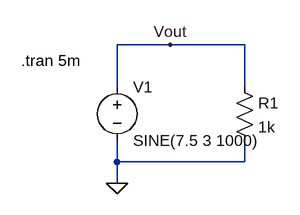
[diagram p0: schematic Plot with Offset.asc]
Plot with Offset.asc, the LTspice schematic file:
Version 4
SHEET 1 880 680
WIRE 176 64 96 64
WIRE 288 64 176 64
WIRE 96 128 96 64
WIRE 288 128 288 64
WIRE 96 240 96 208
WIRE 288 240 288 208
WIRE 288 240 96 240
WIRE 96 272 96 240
FLAG 96 272 0
FLAG 176 64 Vout
SYMBOL voltage 96 112 R0
WINDOW 123 0 0 Left 2
WINDOW 39 0 0 Left 2
SYMATTR InstName V1
SYMATTR Value SINE(7.5 3 1000)
SYMBOL res 272 112 R0
SYMATTR InstName R1
SYMATTR Value 1k
TEXT -48 88 Left 2 !.tran 5m

The netlist it stands for:
* Plot with Offset.asc
V1 Vout 0 SINE(7.5 3 1000)
R1 Vout 0 1k
.tran 5m
.backanno
.end